# EAGLE design test (EAGLE 7.3.0)
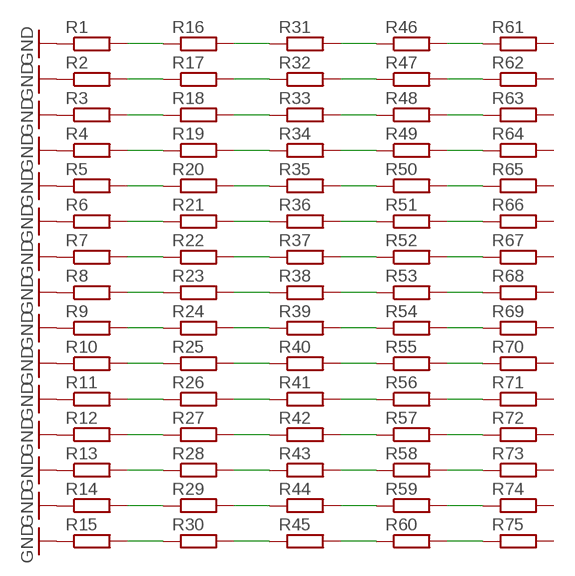
[diagram p0: schematic, sheet 1]

## Parts
R1  R-EU_R1206  [R1206]
R2  R-EU_R1206  [R1206]
R3  R-EU_R1206  [R1206]
R4  R-EU_R1206  [R1206]
R5  R-EU_R1206  [R1206]
R6  R-EU_R1206  [R1206]
R7  R-EU_R1206  [R1206]
R8  R-EU_R1206  [R1206]
R9  R-EU_R1206  [R1206]
R10  R-EU_R1206  [R1206]
R11  R-EU_R1206  [R1206]
R12  R-EU_R1206  [R1206]
R13  R-EU_R1206  [R1206]
R14  R-EU_R1206  [R1206]
R15  R-EU_R1206  [R1206]
R16  R-EU_R1206  [R1206]
R17  R-EU_R1206  [R1206]
R18  R-EU_R1206  [R1206]
R19  R-EU_R1206  [R1206]
R20  R-EU_R1206  [R1206]
R21  R-EU_R1206  [R1206]
R22  R-EU_R1206  [R1206]
R23  R-EU_R1206  [R1206]
R24  R-EU_R1206  [R1206]
R25  R-EU_R1206  [R1206]
R26  R-EU_R1206  [R1206]
R27  R-EU_R1206  [R1206]
R28  R-EU_R1206  [R1206]
R29  R-EU_R1206  [R1206]
R30  R-EU_R1206  [R1206]
R31  R-EU_R1206  [R1206]
R32  R-EU_R1206  [R1206]
R33  R-EU_R1206  [R1206]
R34  R-EU_R1206  [R1206]
R35  R-EU_R1206  [R1206]
R36  R-EU_R1206  [R1206]
R37  R-EU_R1206  [R1206]
R38  R-EU_R1206  [R1206]
R39  R-EU_R1206  [R1206]
R40  R-EU_R1206  [R1206]
R41  R-EU_R1206  [R1206]
R42  R-EU_R1206  [R1206]
R43  R-EU_R1206  [R1206]
R44  R-EU_R1206  [R1206]
R45  R-EU_R1206  [R1206]
R46  R-EU_R1206  [R1206]
R47  R-EU_R1206  [R1206]
R48  R-EU_R1206  [R1206]
R49  R-EU_R1206  [R1206]
R50  R-EU_R1206  [R1206]
R51  R-EU_R1206  [R1206]
R52  R-EU_R1206  [R1206]
R53  R-EU_R1206  [R1206]
R54  R-EU_R1206  [R1206]
R55  R-EU_R1206  [R1206]
R56  R-EU_R1206  [R1206]
R57  R-EU_R1206  [R1206]
R58  R-EU_R1206  [R1206]
R59  R-EU_R1206  [R1206]
R60  R-EU_R1206  [R1206]
R61  R-EU_R1206  [R1206]
R62  R-EU_R1206  [R1206]
R63  R-EU_R1206  [R1206]
R64  R-EU_R1206  [R1206]
R65  R-EU_R1206  [R1206]
R66  R-EU_R1206  [R1206]
R67  R-EU_R1206  [R1206]
R68  R-EU_R1206  [R1206]
R69  R-EU_R1206  [R1206]
R70  R-EU_R1206  [R1206]
R71  R-EU_R1206  [R1206]
R72  R-EU_R1206  [R1206]
R73  R-EU_R1206  [R1206]
R74  R-EU_R1206  [R1206]
R75  R-EU_R1206  [R1206]

## Nets
GND: R1.1 R2.1 R3.1 R4.1 R5.1 R6.1 R7.1 R8.1 R9.1 R10.1 R11.1 R12.1 R13.1 R14.1 R15.1
N$1: R46.2 R61.1
N$2: R1.2 R16.1
N$3: R2.2 R17.1
N$4: R3.2 R18.1
N$5: R4.2 R19.1
N$6: R5.2 R20.1
N$7: R6.2 R21.1
N$8: R7.2 R22.1
N$9: R8.2 R23.1
N$10: R9.2 R24.1
N$11: R10.2 R25.1
N$12: R11.2 R26.1
N$13: R12.2 R27.1
N$14: R13.2 R28.1
N$15: R14.2 R29.1
N$16: R15.2 R30.1
N$17: R16.2 R31.1
N$18: R17.2 R32.1
N$19: R18.2 R33.1
N$20: R19.2 R34.1
N$21: R20.2 R35.1
N$22: R21.2 R36.1
N$23: R22.2 R37.1
N$24: R23.2 R38.1
N$25: R24.2 R39.1
N$26: R25.2 R40.1
N$27: R26.2 R41.1
N$28: R27.2 R42.1
N$29: R28.2 R43.1
N$30: R29.2 R44.1
N$31: R30.2 R45.1
N$32: R31.2 R46.1
N$33: R32.2 R47.1
N$34: R33.2 R48.1
N$35: R34.2 R49.1
N$36: R35.2 R50.1
N$37: R36.2 R51.1
N$38: R37.2 R52.1
N$39: R38.2 R53.1
N$40: R39.2 R54.1
N$41: R40.2 R55.1
N$42: R41.2 R56.1
N$43: R42.2 R57.1
N$44: R43.2 R58.1
N$45: R44.2 R59.1
N$46: R45.2 R60.1
N$47: R47.2 R62.1
N$48: R48.2 R63.1
N$49: R49.2 R64.1
N$50: R50.2 R65.1
N$51: R51.2 R66.1
N$52: R52.2 R67.1
N$53: R53.2 R68.1
N$54: R54.2 R69.1
N$55: R55.2 R70.1
N$56: R56.2 R71.1
N$57: R57.2 R72.1
N$58: R58.2 R73.1
N$59: R59.2 R74.1
N$60: R60.2 R75.1
Unconnected: R61.2 R62.2 R63.2 R64.2 R65.2 R66.2 R67.2 R68.2 R69.2 R70.2 R71.2 R72.2 R73.2 R74.2 R75.2

## Library data of the parts
R1-R75 = resistor:R-EU_: RESISTOR, European symbol

## Board
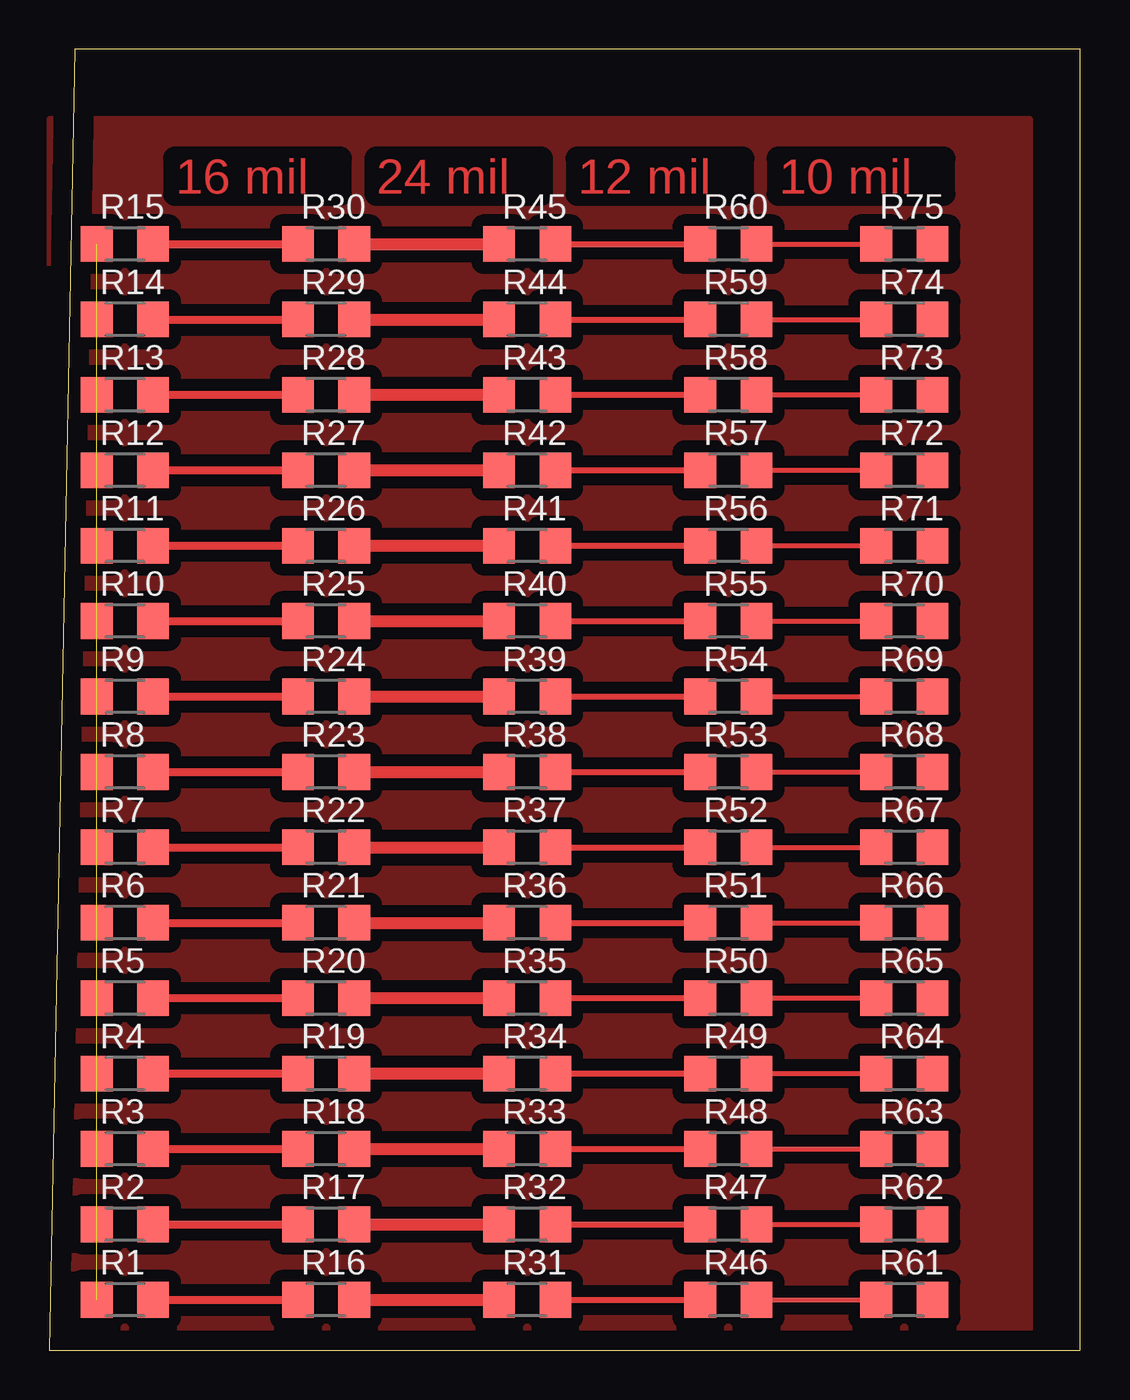
[diagram p1: board, top side]

Size 52.05 x 65.71 mm. Coordinates in mm from the lower left corner, seen from the top.
Outline: 0,0 52.05,0 52.05,65.71 1.27,65.71 0,0
Copper layers (1*16): Top 0.035mm / dielectric 1.5mm / Bottom 0.035mm
Design rules "default": minimum track width 10mil, minimum drill 24mil, track to track 8mil, track to pad 8mil, pad to pad 8mil, via to via 8mil, smd to smd 8mil, copper to edge 40mil, drill to drill 8mil, minimum pad ring 10mil, minimum via ring 8mil, stop-mask expansion 4mil, vias tented up to drill 0mil, thermal gap 10mil

### Footprints (pad centres in the part's own frame; a part is rotated, then mirrored left to right if it is on the bottom)
R1206 = smd 1.6 x 1.803: 1 -1.422,0; 2 1.422,0

### Placement (x,y rotation side)
R1  3.81,2.54 0 top
R2  3.81,6.35 0 top
R3  3.81,10.16 0 top
R4  3.81,13.97 0 top
R5  3.81,17.78 0 top
R6  3.81,21.59 0 top
R7  3.81,25.4 0 top
R8  3.81,29.21 0 top
R9  3.81,33.02 0 top
R10  3.81,36.83 0 top
R11  3.81,40.64 0 top
R12  3.81,44.45 0 top
R13  3.81,48.26 0 top
R14  3.81,52.07 0 top
R15  3.81,55.88 0 top
R16  13.97,2.54 0 top
R17  13.97,6.35 0 top
R18  13.97,10.16 0 top
R19  13.97,13.97 0 top
R20  13.97,17.78 0 top
R21  13.97,21.59 0 top
R22  13.97,25.4 0 top
R23  13.97,29.21 0 top
R24  13.97,33.02 0 top
R25  13.97,36.83 0 top
R26  13.97,40.64 0 top
R27  13.97,44.45 0 top
R28  13.97,48.26 0 top
R29  13.97,52.07 0 top
R30  13.97,55.88 0 top
R31  24.13,2.54 0 top
R32  24.13,6.35 0 top
R33  24.13,10.16 0 top
R34  24.13,13.97 0 top
R35  24.13,17.78 0 top
R36  24.13,21.59 0 top
R37  24.13,25.4 0 top
R38  24.13,29.21 0 top
R39  24.13,33.02 0 top
R40  24.13,36.83 0 top
R41  24.13,40.64 0 top
R42  24.13,44.45 0 top
R43  24.13,48.26 0 top
R44  24.13,52.07 0 top
R45  24.13,55.88 0 top
R46  34.29,2.54 0 top
R47  34.29,6.35 0 top
R48  34.29,10.16 0 top
R49  34.29,13.97 0 top
R50  34.29,17.78 0 top
R51  34.29,21.59 0 top
R52  34.29,25.4 0 top
R53  34.29,29.21 0 top
R54  34.29,33.02 0 top
R55  34.29,36.83 0 top
R56  34.29,40.64 0 top
R57  34.29,44.45 0 top
R58  34.29,48.26 0 top
R59  34.29,52.07 0 top
R60  34.29,55.88 0 top
R61  43.18,2.54 0 top
R62  43.18,6.35 0 top
R63  43.18,10.16 0 top
R64  43.18,13.97 0 top
R65  43.18,17.78 0 top
R66  43.18,21.59 0 top
R67  43.18,25.4 0 top
R68  43.18,29.21 0 top
R69  43.18,33.02 0 top
R70  43.18,36.83 0 top
R71  43.18,40.64 0 top
R72  43.18,44.45 0 top
R73  43.18,48.26 0 top
R74  43.18,52.07 0 top
R75  43.18,55.88 0 top

### Tracks (layer width: path | path; a pad name or v marks a point on that pad's centre or on a via)
GND  (14 unrouted)
N$1
  Top 0.254: R46.2 R61.1
N$2
  Top 0.406: R1.2 R16.1
N$3
  Top 0.406: R2.2 R17.1
N$4
  Top 0.406: R3.2 R18.1
N$5
  Top 0.406: R4.2 R19.1
N$6
  Top 0.406: R5.2 R20.1
N$7
  Top 0.406: R6.2 R21.1 12.7,21.59
N$8
  Top 0.406: R7.2 R22.1
N$9
  Top 0.406: R8.2 R23.1
N$10
  Top 0.406: R9.2 R24.1
N$11
  Top 0.406: R10.2 R25.1
N$12
  Top 0.406: R11.2 R26.1
N$13
  Top 0.406: R12.2 R27.1
N$14
  Top 0.406: R13.2 R28.1
N$15
  Top 0.406: R14.2 R29.1
N$16
  Top 0.406: R15.2 R30.1
N$17
  Top 0.61: R16.2 R31.1
N$18
  Top 0.61: R17.2 R32.1
N$19
  Top 0.61: R18.2 R33.1
N$20
  Top 0.61: R19.2 R34.1
N$21
  Top 0.61: R20.2 R35.1
N$22
  Top 0.61: R21.2 R36.1 22.86,21.59
N$23
  Top 0.61: R22.2 R37.1
N$24
  Top 0.61: R23.2 R38.1
N$25
  Top 0.61: R24.2 R39.1
N$26
  Top 0.61: R25.2 R40.1
N$27
  Top 0.61: R26.2 R41.1
N$28
  Top 0.61: R27.2 R42.1
N$29
  Top 0.61: R28.2 R43.1
N$30
  Top 0.61: R29.2 R44.1
N$31
  Top 0.61: R30.2 R45.1
N$32
  Top 0.305: R31.2 R46.1
N$33
  Top 0.305: R32.2 R47.1
N$34
  Top 0.305: R33.2 R48.1
N$35
  Top 0.305: R34.2 R49.1
N$36
  Top 0.305: R35.2 R50.1
N$37
  Top 0.305: R36.2 R51.1 33.02,21.59
N$38
  Top 0.305: R37.2 R52.1
N$39
  Top 0.305: R38.2 R53.1
N$40
  Top 0.305: R39.2 R54.1
N$41
  Top 0.305: R40.2 R55.1
N$42
  Top 0.305: R41.2 R56.1
N$43
  Top 0.305: R42.2 R57.1
N$44
  Top 0.305: R43.2 R58.1
N$45
  Top 0.305: R44.2 R59.1 33.02,52.07
N$46
  Top 0.305: R45.2 R60.1
N$47
  Top 0.254: R47.2 R62.1
N$48
  Top 0.254: R48.2 R63.1
N$49
  Top 0.254: R49.2 R64.1
N$50
  Top 0.254: R50.2 R65.1
N$51
  Top 0.254: R51.2 R66.1
N$52
  Top 0.254: R52.2 R67.1
N$53
  Top 0.254: R53.2 R68.1
N$54
  Top 0.254: R54.2 R69.1
N$55
  Top 0.254: R55.2 R70.1
N$56
  Top 0.254: R56.2 R71.1 41.91,40.64
N$57
  Top 0.254: R57.2 R72.1
N$58
  Top 0.254: R58.2 R73.1
N$59
  Top 0.254: R59.2 R74.1
N$60
  Top 0.254: R60.2 R75.1
N$61
  pour Top (isolate 0.61): 0,0 0,62.23 49.53,62.23 49.53,0

### Text on the board
Top: 16 mil | 24 mil | 12 mil | 10 mil